# Altium schematic sheet sch_Rev1.1.1_2021-03-04.schdoc
size 525 x 378 mm
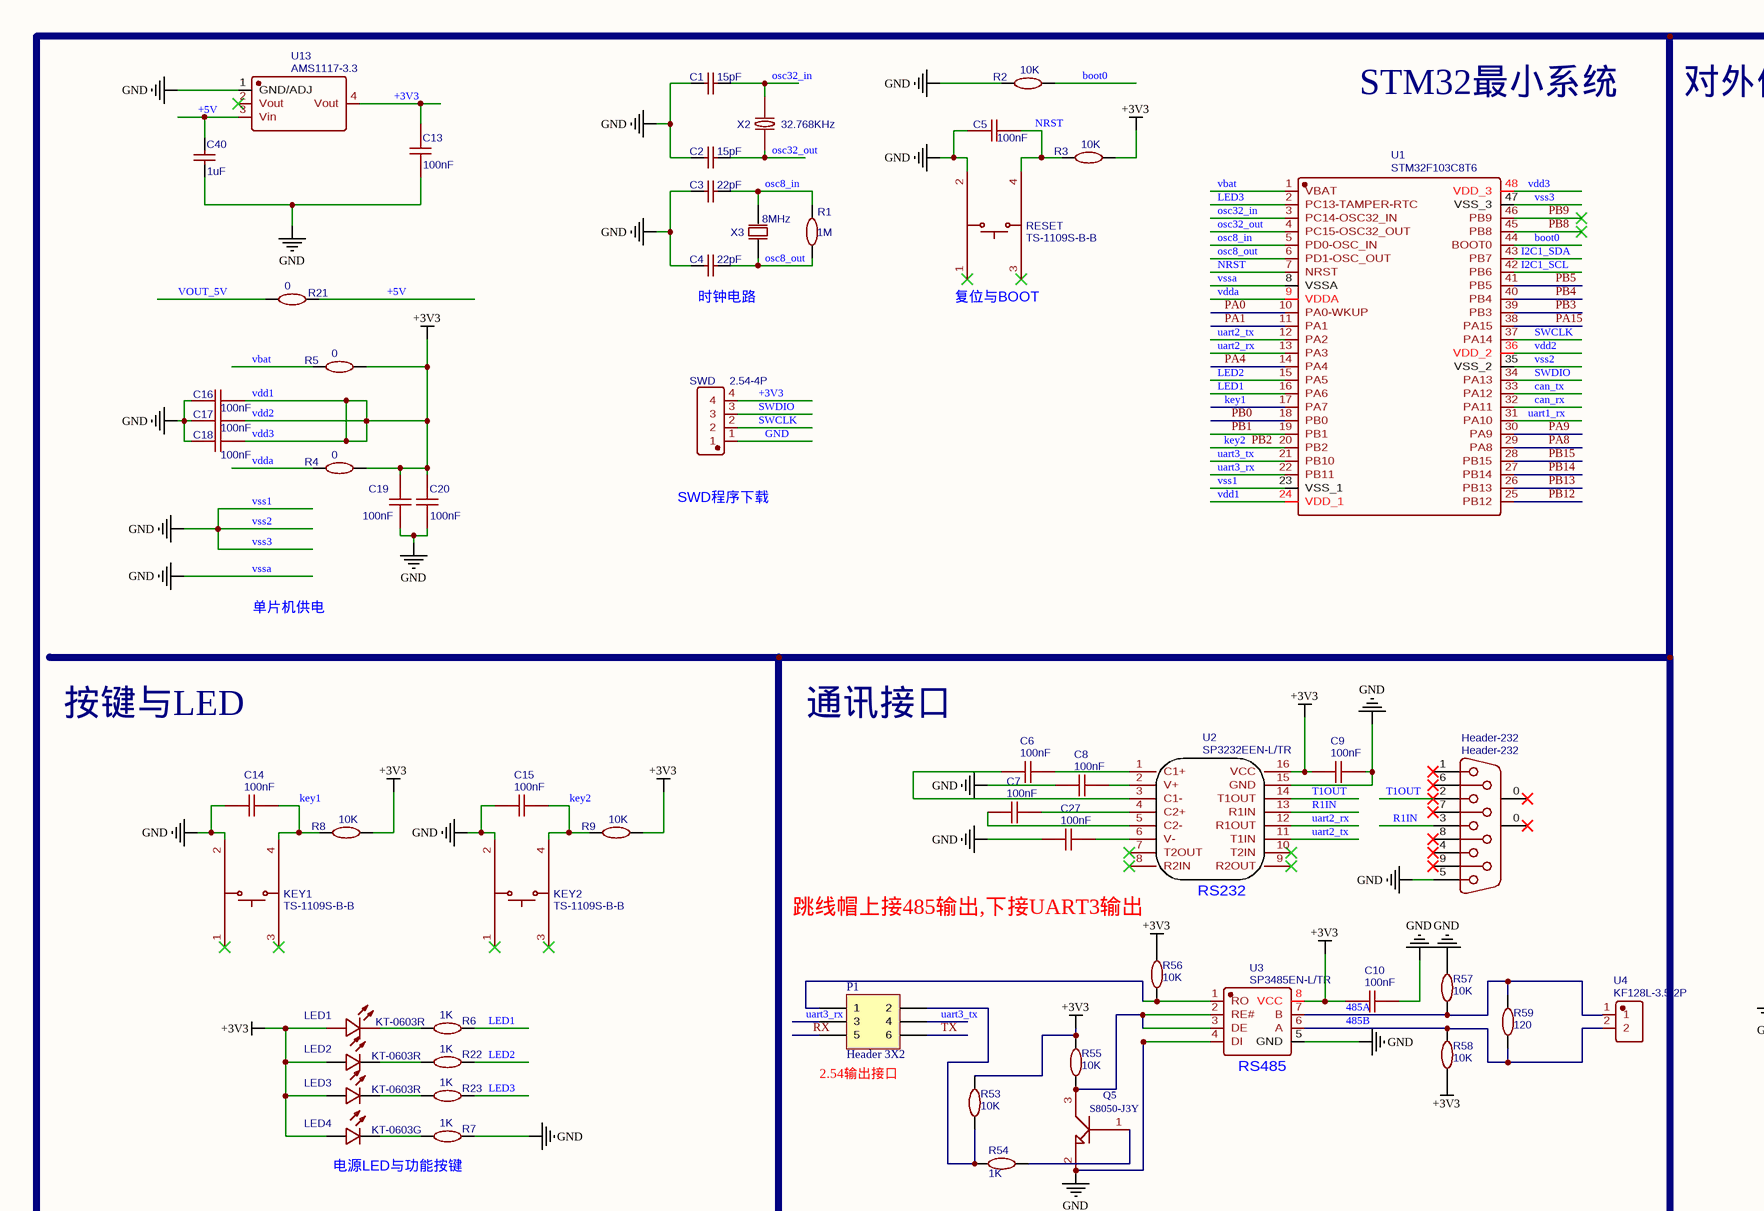
[diagram p0: sch_Rev1.1.1_2021-03-04.schdoc, top left]
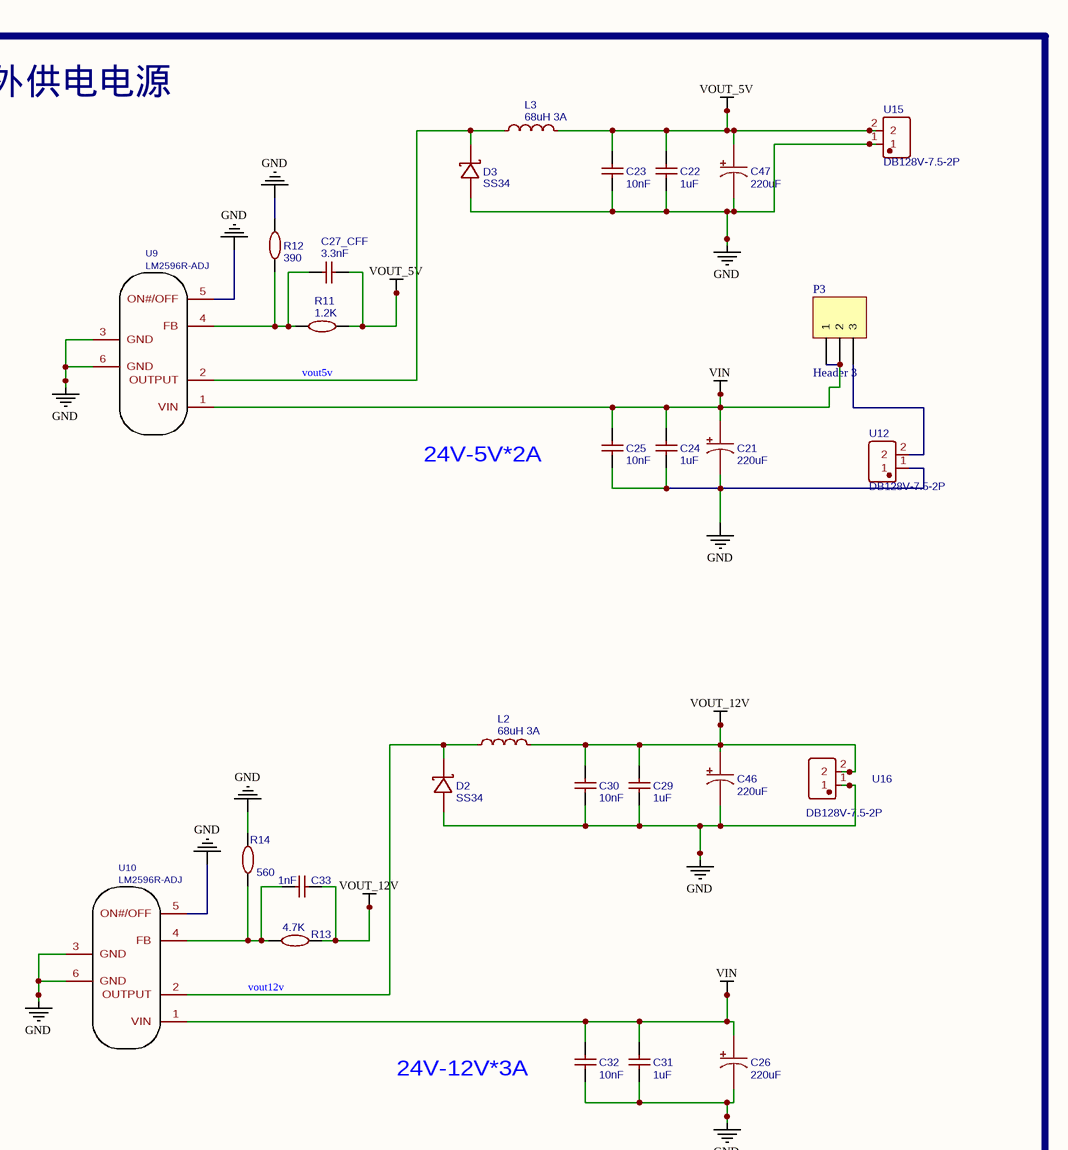
[diagram p1: sch_Rev1.1.1_2021-03-04.schdoc, top right]
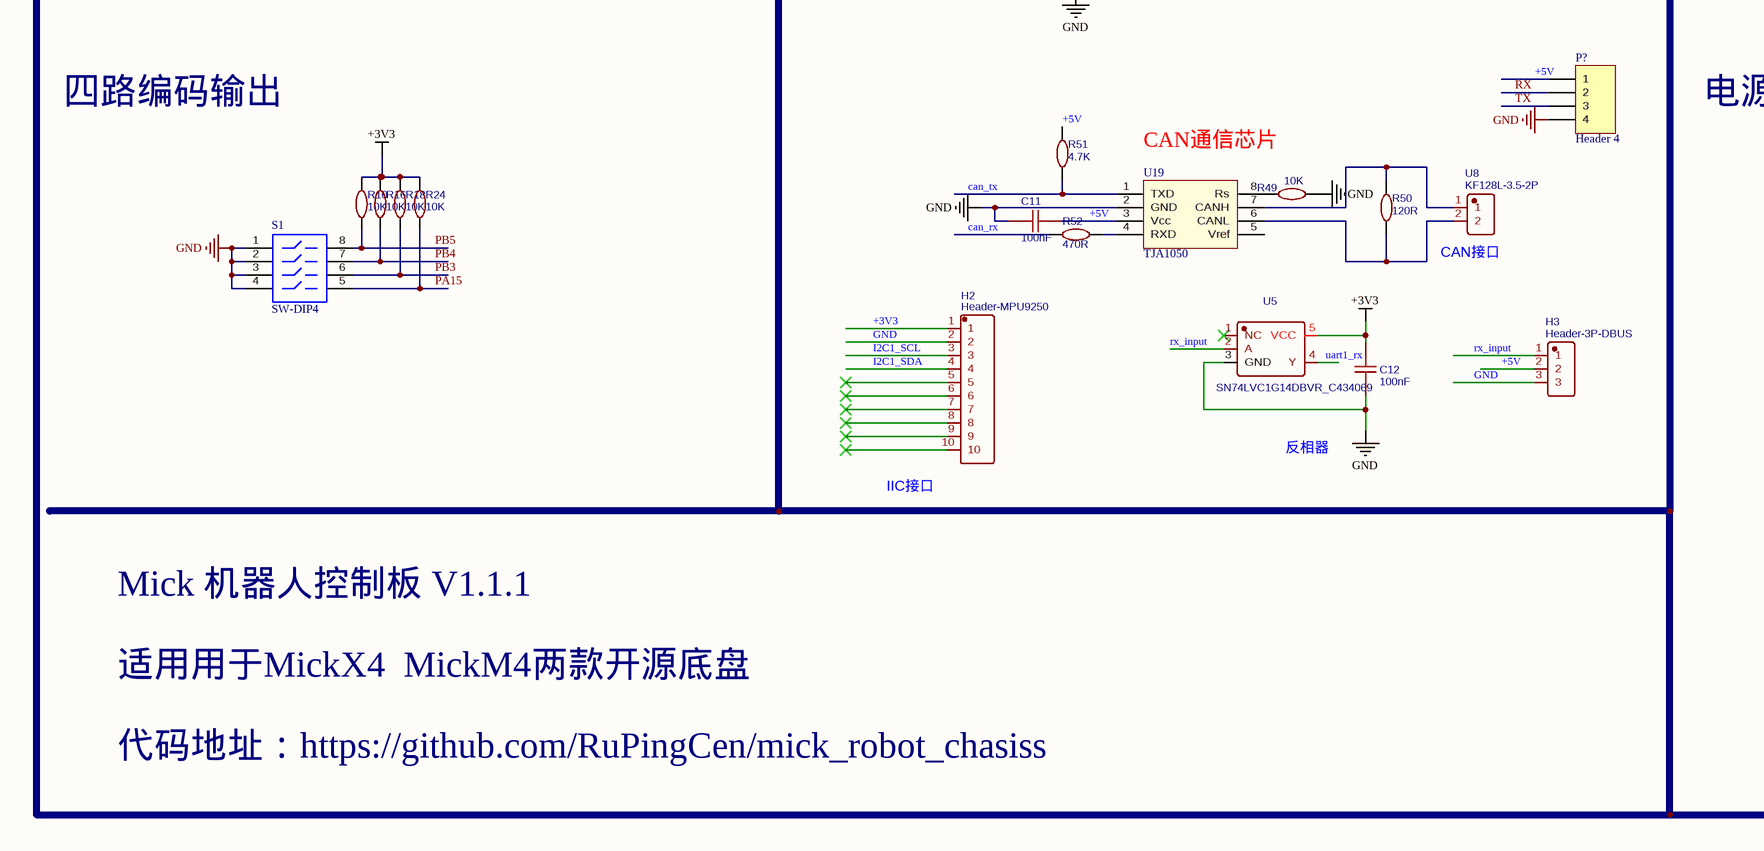
[diagram p2: sch_Rev1.1.1_2021-03-04.schdoc, bottom left]
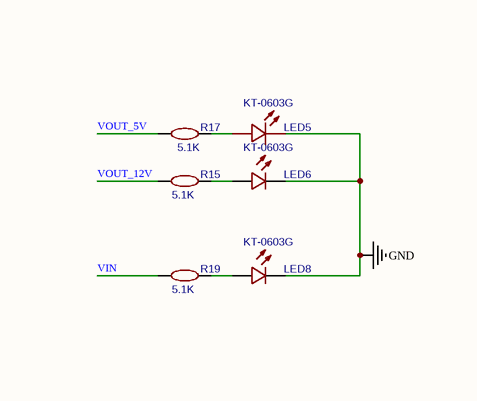
[diagram p3: sch_Rev1.1.1_2021-03-04.schdoc, bottom right]

## Parts
C1  15pF  [C0603]
C2  15pF  [C0603]
C3  22pF  [C0603]
C4  22pF  [C0603]
C5  100nF  [C0603]
C6  100nF  [C0603]
C7  100nF  [C0603]
C8  100nF  [C0603]
C9  100nF  [C0603]
C10  100nF  [C0603]
C11  100nF  [C0603]
C12  100nF  [C0603]
C13  100nF  [C0603]
C14  100nF  [C0603]
C15  100nF  [C0603]
C16  100nF  [C0603]
C17  100nF  [C0603]
C18  100nF  [C0603]
C19  100nF  [C0603]
C20  100nF  [C0603]
C21  220uF  [CAP-SMD_BD10.0-L10.3-W10.3-RD]
C22  1uF  [C0603]
C23  10nF  [C0603]
C24  1uF  [C0603]
C25  10nF  [C0603]
C26  220uF  [CAP-SMD_BD10.0-L10.3-W10.3-RD]
C27  100nF  [C0603]
C27_CFF  3.3nF  [C0603]
C29  1uF  [C0603]
C30  10nF  [C0603]
C31  1uF  [C0603]
C32  10nF  [C0603]
C33  1nF  [C0603]
C40  1uF  [C0603]
C46  220uF  [CAP-SMD_BD8.0-L8.3-W8.3-RD]
C47  220uF  [CAP-SMD_BD8.0-L8.3-W8.3-RD]
D2  SS34  [SMC_L6.9-W5.9-LS7.9-RD]
D3  SS34  [SMC_L6.9-W5.9-LS7.9-RD]
H2  Header-MPU9250  [HDR-TH_10P-P2.54-V]
H3  Header-3P-DBUS  [HDR-TH_3P-P2.54-V]
Header-232  Header-232  [DSUB-TH_9P-P2.74-S2.84_L18.5-W30.8-M]
KEY1  TS-1109S-B-B  [SW-SMD_4P-L4.5-W4.5-P3.00-LS7.0]
KEY2  TS-1109S-B-B  [SW-SMD_4P-L4.5-W4.5-P3.00-LS7.0]
L2  68uH 3A  [IND-SMD_L11.5-W10.0_104CDMCCDS]
L3  68uH 3A  [IND-SMD_L11.5-W10.0_104CDMCCDS]
LED1  KT-0603R  [LED0603-R-RD]
LED2  KT-0603R  [LED0603-R-RD]
LED3  KT-0603R  [LED0603-R-RD]
LED4  KT-0603G  [LED0603-R-RD]
LED5  KT-0603G  [LED0603-R-RD]
LED6  KT-0603G  [LED0603-R-RD]
LED8  KT-0603G  [LED0603-R-RD]
P1  Header 3X2  [HDR2X3]
P3  Header 3  [SW-3]
P?  Header 4  [HDR1X4]
Q5  S8050-J3Y  [S8050-J3Y]
R1  1M  [R0603]
R2  10K  [R0603]
R3  10K  [R0603]
R4  0  [R0603]
R5  0  [R0603]
R6  1K  [R0603]
R7  1K  [R0603]
R8  10K  [R0603]
R9  10K  [R0603]
R10  10K  [R0603]
R11  1.2K  [R0603]
R12  390  [R0603]
R13  4.7K  [R0603]
R14  560  [R0603]
R15  5.1K  [R0603]
R16  10K  [R0603]
R17  5.1K  [R0603]
R18  10K  [R0603]
R19  5.1K  [R0603]
R21  0  [R0603]
R22  1K  [R0603]
R23  1K  [R0603]
R24  10K  [R0603]
R49  10K  [R0603]
R50  120R  [R0603]
R51  4.7K  [R0603]
R52  470R  [R0603]
R53  10K  [R0603]
R54  1K  [R0603]
R55  10K  [R0603]
R56  10K  [R0603]
R57  10K  [R0603]
R58  10K  [R0603]
R59  120  [R0603]
RESET  TS-1109S-B-B  [SW-SMD_4P-L4.5-W4.5-P3.00-LS7.0]
S1  SW-DIP4  [SW-SOP-8]
SWD  2.54-4P  [HDR-TH_4P-P2.54-V]
U1  STM32F103C8T6  [LQFP-48_48P-L7.0-W7.0-P0.50-LS9.0-BL]
U2  SP3232EEN-L/TR  [SOIC-16_L9.9-W3.9-P1.27-LS6.0-BL]
U3  SP3485EN-L/TR  [SOIC-8_L5.0-W4.0-P1.27-LS6.0-BL]
U4  KF128L-3.5-2P  [CONN-TH_P3.50_KF128L-3.5-2P]
U5  SN74LVC1G14DBVR_C434069  [SOT-23-5_L3.0-W1.7-P0.95-LS2.8-BR]
U8  KF128L-3.5-2P  [CONN-TH_P3.50_KF128L-3.5-2P]
U9  LM2596R-ADJ  [TO-263-5_L10.2-W9.9-P1.70-LS14.4-TL]
U10  LM2596R-ADJ  [TO-263-5_L10.2-W9.9-P1.70-LS14.4-TL]
U12  DB128V-7.5-2P  [CONN-TH_2P-P7.50_DB128V-7.5-2P]
U13  AMS1117-3.3  [SOT-223-3_L6.5-W3.4-P2.30-LS7.0-BR]
U15  DB128V-7.5-2P  [CONN-TH_2P-P7.50_DB128V-7.5-2P]
U16  DB128V-7.5-2P  [CONN-TH_2P-P7.50_DB128V-7.5-2P]
U19  TJA1050  [SOP-8]
X2  32.768KHz  [FC-135R_L3.2-W1.5]
X3  8MHz  [OSC-SMD_L11.5-W4.8-P9.50]

## Nets
+3V3: C9.1 C10.1 C12.2 C13.2 C16.2 C17.2 C18.2 C19.2 C20.2 H2.1 LED1.1(A) LED2.1(A) LED3.1(A) LED4.1(A) R3.1 R4.2 R5.2 R8.1 R9.1 R10.2 R16.2 R18.2 R24.2 R53.1 R55.1 R56.1 R58.2 SWD.4 U1.24(VDD_1) U1.36(VDD_2) U1.48(VDD_3) U2.16(VCC) U3.8(VCC) U5.5(VCC) U13.4(Vout)  [also labelled vdd1, vdd2, vdd3]
GND: C1.1 C2.1 C3.1 C4.1 C5.1 C8.1 C9.2 C10.2 C11.2 C12.1 C13.1 C14.1 C15.1 C16.1 C17.1 C18.1 C19.1 C20.1 C21.2 C22.1 C23.1 C24.1 C25.1 C26.2 C27.1 C29.1 C30.1 C31.1 C32.1 C40.1 C46.2 C47.2 D2.2(A) D3.2(A) H2.2 H3.3 Header-232.5 KEY1.2 KEY2.2 LED5.2(K) LED6.2(C) LED8.2(C) P?.4 Q5.2(E) R2.2 R7.2 R12.2 R14.2 R49.1 R57.1 RESET.2 S1.1 S1.2 S1.3 S1.4 SWD.1 U1.8(VSSA) U1.23(VSS_1) U1.35(VSS_2) U1.47(VSS_3) U2.15(GND) U3.4(DI) U3.5(GND) U5.3(GND) U9.3(GND) U9.5(ON#/OFF) U9.6(GND) U10.3(GND) U10.5(ON#/OFF) U10.6(GND) U12.1 U13.1(GND/ADJ) U15.1 U16.1 U19.2(GND)  [also labelled vss1, vss2, vss3, vssa]
VIN: C21.1 C24.2 C25.2 C26.1 C31.2 C32.2 P3.1 P3.2 R19.1 U9.1(VIN) U10.1(VIN)
VOUT_5V: C22.2 C23.2 C27_CFF.2 C47.1 L3.2 R11.2 R17.1 R21.1 U15.2
VOUT_12V: C29.2 C30.2 C33.2 C46.1 L2.2 R13.2 R15.1 U16.2
485A: R57.2 R59.1 U3.7(B) U4.1
485B: R58.1 R59.2 U3.6(A) U4.2
+5V: C11.1 C40.2 H3.2 P?.1 R21.2 R51.1 U13.3(Vin) U19.3(Vcc)
boot0: R2.1 U1.44(BOOT0)
can_rx: R52.1 U1.32(PA11)
can_tx: R51.2 U1.33(PA12) U19.1(TXD)
I2C1_SCL: H2.3 U1.42(PB6)
I2C1_SDA: H2.4 U1.43(PB7)
key1: C14.2 KEY1.4 R8.2 U1.17(PA7)
key2: C15.2 KEY2.4 R9.2 U1.20(PB2)  [also labelled PB2]
LED1: R6.2 U1.16(PA6)
LED2: R22.2 U1.15(PA5)
LED3: R23.2 U1.2(PC13-TAMPER-RTC)
NRST: C5.2 R3.2 RESET.4 U1.7(NRST)
osc8_in: C3.2 R1.2 U1.5(PD0-OSC_IN) X3.1(OSC1)
osc8_out: C4.2 R1.1 U1.6(PD1-OSC_OUT) X3.2(OSC2)
osc32_in: C1.2 U1.3(PC14-OSC32_IN) X2.2
osc32_out: C2.2 U1.4(PC15-OSC32_OUT) X2.1
PA0: U1.10(PA0-WKUP)
PA1: U1.11(PA1)
PA4: U1.14(PA4)
PA8: U1.29(PA8)
PA9: U1.30(PA9)
PA15: R24.1 S1.5 U1.38(PA15)
PB0: U1.18(PB0)
PB1: U1.19(PB1)
PB3: R18.1 S1.6 U1.39(PB3)
PB4: R16.1 S1.7 U1.40(PB4)
PB5: R10.1 S1.8 U1.41(PB5)
PB8: U1.45(PB8)
PB9: U1.46(PB9)
PB12: U1.25(PB12)
PB13: U1.26(PB13)
PB14: U1.27(PB14)
PB15: U1.28(PB15)
R1IN: Header-232.3 U2.13(R1IN)
RX: P1.5 P?.2
rx_input: H3.1 U5.2(A)
SWCLK: SWD.2 U1.37(PA14)
SWDIO: SWD.3 U1.34(PA13)
T1OUT: Header-232.2 U2.14(T1OUT)
TX: P1.6 P?.3
uart1_rx: U1.31(PA10) U5.4(Y)
uart2_rx: U1.13(PA3) U2.12(R1OUT)
uart2_tx: U1.12(PA2) U2.11(T1IN)
uart3_rx: P1.3 U1.22(PB11)
uart3_tx: P1.4 U1.21(PB10)
vbat: R5.1 U1.1(VBAT)
vdda: R4.1 U1.9(VDDA)
vout5v: D3.1(K) L3.1 U9.2(OUTPUT)
vout12v: D2.1(K) L2.1 U10.2(OUTPUT)
NetC6_1: C6.1 U2.3(C1-)
NetC6_2: C6.2 U2.1(C1+)
NetC7_1: C7.1 U2.5(C2-)
NetC7_2: C7.2 U2.4(C2+)
NetC8_2: C8.2 U2.2(V+)
NetC27_2: C27.2 U2.6(V-)
NetC27_CFF_1: C27_CFF.1 R11.1 R12.1 U9.4(FB)
NetC33_1: C33.1 R13.1 R14.1 U10.4(FB)
NetLED1_2: LED1.2(K) R6.1
NetLED2_2: LED2.2(C) R22.1
NetLED3_2: LED3.2(C) R23.1
NetLED4_2: LED4.2(C) R7.1
NetLED5_1: LED5.1(A) R17.2
NetLED6_1: LED6.1(A) R15.2
NetLED8_1: LED8.1(A) R19.2
NetP1_1: P1.1 R56.2 U3.1(RO)
NetP1_2: P1.2 R53.2 R54.1
NetP3_3: P3.3 U12.2
NetQ5_1: Q5.1(B) R54.2
NetQ5_3: Q5.3(C) R55.2 U3.2(RE#) U3.3(DE)
NetR49_2: R49.2 U19.8(Rs)
NetR50_1: R50.1 U8.1 U19.7(CANH)
NetR50_2: R50.2 U8.2 U19.6(CANL)
NetR52_2: R52.2 U19.4(RXD)

Not connected (* = marked no-connect by the designer): H2 5* 6* 7* 8* 9* 10*; Header-232 0* 1* 4* 6* 7* 8* 9*; KEY1 1* 3*; KEY2 1* 3*; RESET 1* 3*; U2 7(T2OUT)* 8(R2IN)* 9(R2OUT)* 10(T2IN)*; U5 1(NC)*; U13 2(Vout)*; U19 5(Vref)

## Notes on the sheet
- STM32最小系统
- 对外供电电源
- (near C4) 时钟电路
- (near RESET) 复位与BOOT
- 24V-5V*2A
- (near SWD) SWD程序下载
- 单片机供电
- 按键与LED
- 通讯接口
- (near U2) RS232
- 跳线帽上接485输出,下接UART3输出
- (near P1) 2.54输出接口
- (near U3) RS485
- 24V-12V*3A
- 电源LED与功能按键
- 四路编码输出
- 电源指示灯
- (near U19) CAN通信芯片
- (near U8) CAN接口
- 反相器
- (near H2) IIC接口
- Mick 机器人控制板 V1.1.1
- 适用用于MickX4  MickM4两款开源底盘
- 代码地址：https://github.com/RuPingCen/mick_robot_chasiss

## Library data of the parts
C1 C2 = 15pF: BOM_Manufacturer Part: CL10C150JB8NNNC; BOM_Manufacturer: SAMSUNG; nameAlias: Capacitance; SMT Type: Basic; BOM_Supplier: LCSC; BOM_Supplier Part: C1644; BOM_JLCPCB SMD: Yes; spicePre: C; spiceSymbolName: CL10C150JB8NNNC
C3 C4 = 22pF: BOM_Manufacturer Part: CL10C220JB8NNNC; BOM_Manufacturer: SAMSUNG; nameAlias: Capacitance; SMT Type: Basic; BOM_Supplier: LCSC; BOM_Supplier Part: C1653; BOM_JLCPCB SMD: Yes; spicePre: C; spiceSymbolName: CL10C220JB8NNNC
C5-C20 C27 = 100nF: BOM_Manufacturer: YAGEO; BOM_Manufacturer Part: CC0603KRX7R9BB104; nameAlias: Capacitance; SMT Type: Basic; BOM_Supplier: LCSC; BOM_Supplier Part: C14663; BOM_JLCPCB SMD: Yes; spicePre: C; spiceSymbolName: CC0603KRX7R9BB104
C21 C26 = 270uF: 50V; BOM_Manufacturer: Lelon; BOM_Manufacturer Part: HBW271M1VTR-1010K; nameAlias: Capacitance; Contributor: LCSC; SMT Type: Extend; BOM_Supplier: LCSC; BOM_Supplier Part: C311670; BOM_JLCPCB SMD: Yes; spicePre: C; spiceSymbolName: HBW271M1VTR-1010K
C22 C24 C29 C31 = 1uF: BOM_Manufacturer Part: CL10A105KB8NNNC; BOM_Manufacturer: SAMSUNG; nameAlias: Capacitance; SMT Type: Basic; BOM_Supplier: LCSC; BOM_Supplier Part: C15849; BOM_JLCPCB SMD: Yes; spicePre: C; spiceSymbolName: CL10A105KB8NNNC
C23 C25 C30 C32 = 10nF: BOM_Manufacturer: FH; BOM_Manufacturer Part: 0603B103K500NT; nameAlias: Capacitance; SMT Type: Basic; BOM_Supplier: LCSC; BOM_Supplier Part: C57112; BOM_JLCPCB SMD: Yes; spicePre: C; spiceSymbolName: 0603B103K500NT
C27_CFF = 3.3nF: BOM_Manufacturer Part: CL10B332KB8NNNC; BOM_Manufacturer: SAMSUNG; nameAlias: Capacitance; SMT Type: Basic; BOM_Supplier: LCSC; BOM_Supplier Part: C1613; BOM_JLCPCB SMD: Yes; spicePre: C; spiceSymbolName: CL10B332KB8NNNC
C33 = 1nF: BOM_Manufacturer Part: CL10B102KB8NNNC; BOM_Manufacturer: SAMSUNG; nameAlias: Capacitance; SMT Type: Basic; BOM_Supplier: LCSC; BOM_Supplier Part: C1588; BOM_JLCPCB SMD: Yes; spicePre: C; spiceSymbolName: CL10B102KB8NNNC
C40 = 470nF: BOM_Manufacturer Part: CL21B474KBFNNNE; BOM_Manufacturer: SAMSUNG; nameAlias: Capacitance; SMT Type: Basic; BOM_Supplier: LCSC; BOM_Supplier Part: C13967; BOM_JLCPCB SMD: Yes; spicePre: C; spiceSymbolName: CL21B474KBFNNNE
C46 C47 = 220uF: 25V; BOM_Manufacturer: Lelon; BOM_Manufacturer Part: VEH221M1VTR-0810; nameAlias: Capacitance; Contributor: LCSC; SMT Type: Extend; BOM_Supplier: LCSC; BOM_Supplier Part: C311611; BOM_JLCPCB SMD: Yes; spicePre: C; spiceSymbolName: VEH221M1VTR-0810
D2 D3 = B540C-13-F: BOM_Manufacturer: DIODES; SMT Type: Extend; BOM_Supplier: LCSC; BOM_Manufacturer Part: B540C-13-F; BOM_Supplier Part: C72264; BOM_JLCPCB SMD: Yes; spicePre: D; spiceSymbolName: B540C-13-F
H2 = Header-Male-2.54_1x10: BOM_Manufacturer Part: Headers  Pins2.54mm1*10P; SMT Type: Extend; BOM_Supplier: LCSC; image: http://image.lceda.cn/szlcsc/C57369.jpg; BOM_Supplier Part: C57369; BOM_JLCPCB SMD: Yes; spicePre: H; spiceSymbolName: Header-Male-2.54_1x10
H3 = Z-211-0311-0021-001: 蓝色排针; BOM_Manufacturer: ZHENGLING; Contributor: LCSC; SMT Type: Extend; BOM_Supplier: LCSC; BOM_Manufacturer Part: Z-211-0311-0021-001; BOM_Supplier Part: C152153; BOM_JLCPCB SMD: Yes; spicePre: H; spiceSymbolName: Z-211-0311-0021-001
Header-232 = 5747844-6: BOM_Manufacturer: TE Connectivity; Contributor: LCSC; SMT Type: Extend; BOM_Supplier: LCSC; BOM_Supplier Part: C305943; BOM_Manufacturer Part: 5747844-6; BOM_JLCPCB SMD: Yes; spicePre: D; spiceSymbolName: 5747844-6
KEY1 KEY2 RESET = TS-1109S-B-B: BOM_Manufacturer: XKB Enterprise; Contributor: LCSC; SMT Type: Extend; BOM_Supplier: LCSC; BOM_Supplier Part: C480315; BOM_Manufacturer Part: TS-1109S-B-B; BOM_JLCPCB SMD: Yes; spicePre: S; spiceSymbolName: TS-1109S-B-B
L2 = 68uH 3A: BOM_Manufacturer: YJYCOIN; BOM_Manufacturer Part: YSPI1050-680M; nameAlias: Inductance; Contributor: LCSC; SMT Type: Extend; BOM_Supplier: LCSC; BOM_Supplier Part: C497902; BOM_JLCPCB SMD: Yes; spicePre: L; spiceSymbolName: YSPI1050-680M
L3 = 68uH: BOM_Manufacturer: YJYCOIN; BOM_Manufacturer Part: YSPI1050-680M; nameAlias: Inductance; Contributor: LCSC; SMT Type: Extend; BOM_Supplier: LCSC; BOM_Supplier Part: C497902; BOM_JLCPCB SMD: Yes; spicePre: L; spiceSymbolName: YSPI1050-680M
LED1 = R: BOM_Manufacturer: KENTO; SMT Type: Basic; BOM_Supplier: LCSC; BOM_Manufacturer Part: KT-0603R; image: //image.lceda.cn/szlcsc/C2286.jpg; BOM_Supplier Part: C2286; BOM_JLCPCB SMD: Yes; spicePre: L; spiceSymbolName: KT-0603R
LED2 = YR: BOM_Manufacturer: EVERLIGHT; BOM_Manufacturer Part: 19-217/GHC-YR1S2/3T; SMT Type: Basic; BOM_Supplier: LCSC; image: //image.lceda.cn/szlcsc/C72043.jpg; BOM_Supplier Part: C72043; BOM_JLCPCB SMD: Yes; spicePre: L; spiceSymbolName: 19-217/GHC-YR1S2/3T
LED3 LED4 = CY: BOM_Manufacturer: EVERLIGHT; BOM_Manufacturer Part: 19-213/Y2C-CQ2R2L/3T(CY); SMT Type: Basic; BOM_Supplier: LCSC; image: //image.lceda.cn/szlcsc/C72038.jpg; BOM_Supplier Part: C72038; BOM_JLCPCB SMD: Yes; spicePre: L; spiceSymbolName: 19-213/Y2C-CQ2R2L/3T(CY)
LED5 = KT-0603R: BOM_Manufacturer: KENTO; SMT Type: Basic; BOM_Supplier: LCSC; BOM_Manufacturer Part: KT-0603R; image: //image.lceda.cn/szlcsc/C2286.jpg; BOM_Supplier Part: C2286; BOM_JLCPCB SMD: Yes; spicePre: L; spiceSymbolName: KT-0603R
LED6 = 19-213/Y2C-CQ2R2L/3T(CY): BOM_Manufacturer: EVERLIGHT; SMT Type: Basic; BOM_Supplier: LCSC; BOM_Manufacturer Part: 19-213/Y2C-CQ2R2L/3T(CY); image: //image.lceda.cn/szlcsc/C72038.jpg; BOM_Supplier Part: C72038; BOM_JLCPCB SMD: Yes; spicePre: L; spiceSymbolName: 19-213/Y2C-CQ2R2L/3T(CY)
LED8 = 19-217/GHC-YR1S2/3T: BOM_Manufacturer: EVERLIGHT; SMT Type: Basic; BOM_Supplier: LCSC; BOM_Manufacturer Part: 19-217/GHC-YR1S2/3T; image: //image.lceda.cn/szlcsc/C72043.jpg; BOM_Supplier Part: C72043; BOM_JLCPCB SMD: Yes; spicePre: L; spiceSymbolName: 19-217/GHC-YR1S2/3T
P1 = Header 3X2: Header, 3-Pin, Dual row 485切换 （黑）; LatestRevisionDate: 17-Jul-2002; LatestRevisionNote: Re-released for DXP Platform.; Publisher: Altium Limited
P3 = Header 3: Header, 3-Pin 电源开关; LatestRevisionDate: 17-Jul-2002; LatestRevisionNote: Re-released for DXP Platform.; Publisher: Altium Limited
P? = Header 4: Header, 4-Pin 串口3输出; LatestRevisionDate: 17-Jul-2002; LatestRevisionNote: Re-released for DXP Platform.; Publisher: Altium Limited
R1 = 1M: BOM_Manufacturer: UniOhm; BOM_Manufacturer Part: 0603WAF1004T5E; nameAlias: Resistance (Ohms); SMT Type: Basic; BOM_Supplier: LCSC; BOM_Supplier Part: C22935; BOM_JLCPCB SMD: Yes; spicePre: R; spiceSymbolName: 0603WAF1004T5E
R2 R3 R8 R9 R49-R59 = 10K: BOM_Manufacturer: UniOhm; BOM_Manufacturer Part: 0603WAF1002T5E; nameAlias: Resistance (Ohms); SMT Type: Basic; BOM_Supplier: LCSC; BOM_Supplier Part: C25804; BOM_JLCPCB SMD: Yes; spicePre: R; spiceSymbolName: 0603WAF1002T5E
R4 R5 R21 = 0: BOM_Manufacturer: UniOhm; BOM_Manufacturer Part: 0603WAF0000T5E; nameAlias: Resistance (Ohms); SMT Type: Basic; BOM_Supplier: LCSC; BOM_Supplier Part: C21189; BOM_JLCPCB SMD: Yes; spicePre: R; spiceSymbolName: 0603WAF0000T5E
R6 R7 R10 R16-R18 R22-R24 = 1K: BOM_Manufacturer: UniOhm; BOM_Manufacturer Part: 0603WAF1001T5E; nameAlias: Resistance (Ohms); SMT Type: Basic; BOM_Supplier: LCSC; BOM_Supplier Part: C21190; BOM_JLCPCB SMD: Yes; spicePre: R; spiceSymbolName: 0603WAF1001T5E
R11 = 1.2K: BOM_Manufacturer: UniOhm; BOM_Manufacturer Part: 0603WAF1201T5E; nameAlias: Resistance (Ohms); SMT Type: Basic; BOM_Supplier: LCSC; BOM_Supplier Part: C22765; BOM_JLCPCB SMD: Yes; spicePre: R; spiceSymbolName: 0603WAF1201T5E
R12 = 390: BOM_Manufacturer: UniOhm; BOM_Manufacturer Part: 0603WAF3900T5E; nameAlias: Resistance (Ohms); SMT Type: Basic; BOM_Supplier: LCSC; BOM_Supplier Part: C23151; BOM_JLCPCB SMD: Yes; spicePre: R; spiceSymbolName: 0603WAF3900T5E
R13 = 4.7K: BOM_Manufacturer: UniOhm; BOM_Manufacturer Part: 0603WAF4701T5E; nameAlias: Resistance (Ohms); SMT Type: Basic; BOM_Supplier: LCSC; BOM_Supplier Part: C23162; BOM_JLCPCB SMD: Yes; spicePre: R; spiceSymbolName: 0603WAF4701T5E
R14 = 560: BOM_Manufacturer: UniOhm; BOM_Manufacturer Part: 0603WAF5600T5E; nameAlias: Resistance (Ohms); SMT Type: Basic; BOM_Supplier: LCSC; BOM_Supplier Part: C23204; BOM_JLCPCB SMD: Yes; spicePre: R; spiceSymbolName: 0603WAF5600T5E
R15 = 2.4K: BOM_Manufacturer: UniOhm; BOM_Manufacturer Part: 0603WAF2401T5E; nameAlias: Resistance (Ohms); SMT Type: Basic; BOM_Supplier: LCSC; BOM_Supplier Part: C22940; BOM_JLCPCB SMD: Yes; spicePre: R; spiceSymbolName: 0603WAF2401T5E
R19 = 5.1K: BOM_Manufacturer Part: 0603WAF5101T5E; BOM_Manufacturer: UniOhm; nameAlias: Resistance (Ohms); SMT Type: Basic; BOM_Supplier: LCSC; BOM_Supplier Part: C23186; BOM_JLCPCB SMD: Yes; spicePre: R; spiceSymbolName: 0603WAF5101T5E
S1 = SW-DIP4: DIP Switch 拨码开关; Published: 24-Mar-1999; LatestRevisionDate: 17-Jul-2002; LatestRevisionNote: Re-released for DXP Platform.; PackageReference: DIP-8; Publisher: Altium Limited
SWD = 2.54-4P: SWD程序下载 （黄色）; BOM_Manufacturer: ZHENGLING; BOM_Manufacturer Part: Z-211-0411-0021-001; Contributor: LCSC; SMT Type: Extend; BOM_Supplier: LCSC; BOM_Supplier Part: C152150; BOM_JLCPCB SMD: Yes; spicePre: H; spiceSymbolName: Z-211-0411-0021-001
U1 = STM32F103C8T6: BOM_Manufacturer: STMicroelectronics; SMT Type: Basic; timeStamp: 1455028086; BOM_Supplier: LCSC; BOM_Manufacturer Part: STM32F103C8T6; image: //image.lceda.cn/szlcsc/C8734.jpg; BOM_Supplier Part: C8734; BOM_JLCPCB SMD: Yes; spicePre: U; spiceSymbolName: STM32F103C8T6
U2 = SP3232EEN-L/TR: BOM_Manufacturer: EXAR; SMT Type: Extend; BOM_Supplier: LCSC; BOM_Manufacturer Part: SP3232EEN-L/TR; image: //image.lceda.cn/szlcsc/C9378.jpg; BOM_Supplier Part: C9378; BOM_JLCPCB SMD: Yes; spicePre: U; spiceSymbolName: SP3232EEN-L/TR
U3 = SP3485EN-L/TR: 485芯片; BOM_Manufacturer: EXAR; SMT Type: Basic; BOM_Supplier: LCSC; BOM_Manufacturer Part: SP3485EN-L/TR; image: //image.lceda.cn/szlcsc/C8963.jpg; BOM_Supplier Part: C8963; BOM_JLCPCB SMD: Yes; spicePre: U; spiceSymbolName: SP3485EN-L/TR
U4 U8 = KF128L-3.5-2P: 接头3.5; BOM_Manufacturer: Cixi Kefa Elec; Contributor: LCSC; SMT Type: Extend; BOM_Supplier: LCSC; BOM_Supplier Part: C474930; BOM_Manufacturer Part: KF128L-3.5-2P; BOM_JLCPCB SMD: Yes; spicePre: U; spiceSymbolName: KF128L-3.5-2P
U5 = SN74LVC1G14DBVR_C434069: 反向器; BOM_Manufacturer: Youtai Semiconductor Co., Ltd.; Contributor: LCSC; SMT Type: Extend; BOM_Supplier: LCSC; BOM_Supplier Part: C434069; BOM_Manufacturer Part: SN74LVC1G14DBVR; BOM_JLCPCB SMD: Yes; spicePre: U; spiceSymbolName: SN74LVC1G14DBVR_C434069
U9 U10 = LM2596R-ADJ: BOM_Manufacturer: TI; BOM_Manufacturer Part: LM2596SX-ADJ/NOPB; SMT Type: Extend; BOM_Supplier: LCSC; image: //image.lceda.cn/szlcsc/C52684.jpg; BOM_Supplier Part: C29781; BOM_LCSC Assembly: Yes; spicePre: U; spiceSymbolName: LM2596R-ADJ
U12 U15 U16 = DB128V-7.5-2P: 接头7.5; BOM_Manufacturer: DIBO; Contributor: LCSC; SMT Type: Extend; BOM_Supplier: LCSC; BOM_Supplier Part: C395865; BOM_Manufacturer Part: DB128V-7.5-2P; BOM_JLCPCB SMD: Yes; spicePre: U; spiceSymbolName: DB128V-7.5-2P
U13 = AMS1117-3.3: BOM_Manufacturer: AMS; sourceId: dwIGgezVh; SMT Type: Basic; timeStamp: 1476261164; BOM_Supplier: LCSC; BOM_Manufacturer Part: AMS1117-3.3; image: //image.lceda.cn/szlcsc/C6186.jpg; BOM_Supplier Part: C6186; BOM_JLCPCB SMD: Yes; spicePre: U; spiceSymbolName: AMS1117-3.3
U19 = PCA82C250: CAN收发
X2 = 32.768KHz: BOM_Manufacturer Part: Q13FC1350000400; BOM_Manufacturer: EPSON; nameAlias: Frequency; SMT Type: Basic; BOM_Supplier: LCSC; BOM_Supplier Part: C32346; BOM_JLCPCB SMD: Yes; spicePre: X; spiceSymbolName: Q13FC1350000400
X3 = 8MHz: BOM_Manufacturer: YXC; BOM_Manufacturer Part: X49SM8MSD2SC; nameAlias: Frequency; BOM_Supplier: LCSC; BOM_Supplier Part: C12674; spicePre: X; spiceSymbolName: X49SM8MSD2SC